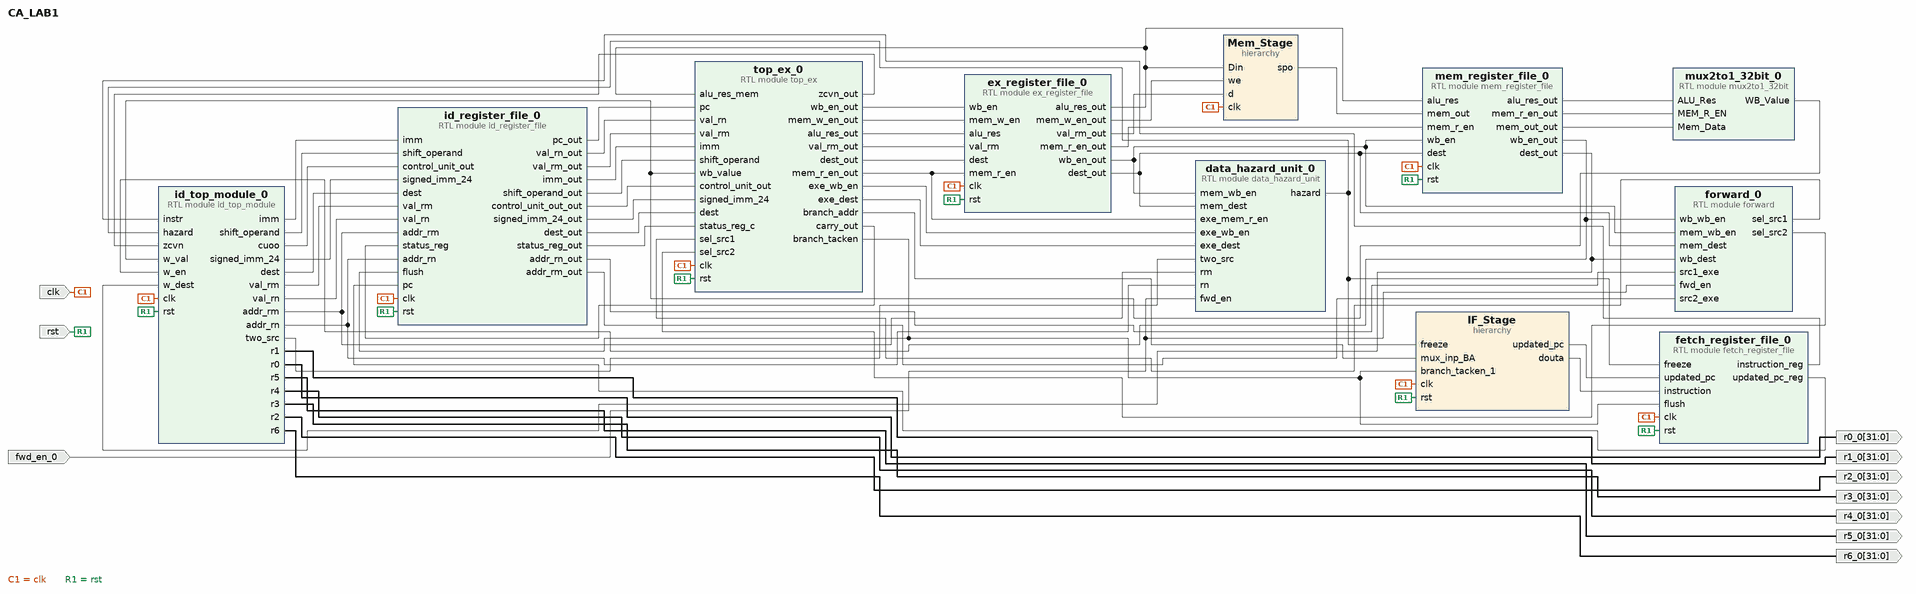
[diagram p0: block diagram of the top level]
# Vivado block design CA_LAB1, xc7z010clg400-1, Vivado 2018.3
create_bd_design CA_LAB1

create_bd_port -dir I -type clk clk
set_property -dict {CONFIG.ASSOCIATED_RESET rst} [get_bd_ports clk]
create_bd_port -dir I -type rst rst
create_bd_port -dir O -from 31 -to 0 r1_0
create_bd_port -dir O -from 31 -to 0 r0_0
create_bd_port -dir O -from 31 -to 0 r5_0
create_bd_port -dir O -from 31 -to 0 r4_0
create_bd_port -dir O -from 31 -to 0 r3_0
create_bd_port -dir O -from 31 -to 0 r2_0
create_bd_port -dir O -from 31 -to 0 r6_0
create_bd_port -dir I fwd_en_0

create_bd_cell -type module -reference fetch_register_file fetch_register_file_0
create_bd_cell -type hier IF_Stage
create_bd_cell -type module -reference mem_register_file mem_register_file_0
create_bd_cell -type module -reference mux2to1_32bit mux2to1_32bit_0
create_bd_cell -type hier Mem_Stage
create_bd_cell -type module -reference id_top_module id_top_module_0
create_bd_cell -type module -reference data_hazard_unit data_hazard_unit_0
create_bd_cell -type module -reference forward forward_0
create_bd_cell -type module -reference id_register_file id_register_file_0
create_bd_cell -type module -reference ex_register_file ex_register_file_0
create_bd_cell -type module -reference top_ex top_ex_0

# ---- hierarchy /IF_Stage ----
current_bd_instance /IF_Stage
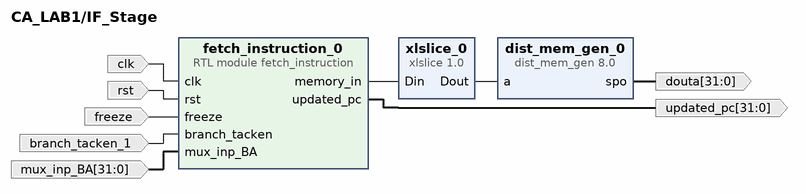
[diagram p1: block diagram inside /IF_Stage]
create_bd_pin -dir I -type clk clk
create_bd_pin -dir I -type rst rst
create_bd_pin -dir O -from 31 -to 0 updated_pc
create_bd_pin -dir O -from 31 -to 0 douta
create_bd_pin -dir I freeze
create_bd_pin -dir I branch_tacken_1
create_bd_pin -dir I -from 31 -to 0 mux_inp_BA

create_bd_cell -type ip -vlnv xilinx.com:ip:xlslice:1.0 xlslice_0
set_property -dict {CONFIG.DIN_FROM 12 CONFIG.DIN_TO 0 CONFIG.DOUT_WIDTH 13} [get_bd_cells xlslice_0]
create_bd_cell -type ip -vlnv xilinx.com:ip:dist_mem_gen:8.0 dist_mem_gen_0
set_property -dict [list \
  CONFIG.coefficient_file ../../../../../../../../Files/output_ultimate.coe \
  CONFIG.data_width 32 \
  CONFIG.depth 8192 \
  CONFIG.memory_type rom \
] [get_bd_cells dist_mem_gen_0]
create_bd_cell -type module -reference fetch_instruction fetch_instruction_0

# ---- hierarchy /Mem_Stage ----
current_bd_instance /Mem_Stage
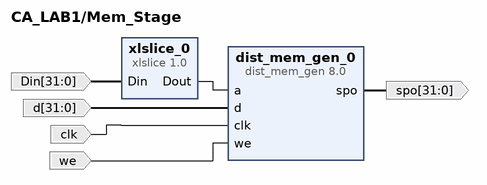
[diagram p2: block diagram inside /Mem_Stage]
create_bd_pin -dir I -from 31 -to 0 Din
create_bd_pin -dir I -from 31 -to 0 d
create_bd_pin -dir I clk
create_bd_pin -dir I we
create_bd_pin -dir O -from 31 -to 0 spo

create_bd_cell -type ip -vlnv xilinx.com:ip:xlslice:1.0 xlslice_0
set_property -dict {CONFIG.DIN_FROM 10 CONFIG.DOUT_WIDTH 11} [get_bd_cells xlslice_0]
create_bd_cell -type ip -vlnv xilinx.com:ip:dist_mem_gen:8.0 dist_mem_gen_0
set_property -dict {CONFIG.data_width 32 CONFIG.depth 2048} [get_bd_cells dist_mem_gen_0]

# ---- connections ----

current_bd_instance /IF_Stage
connect_bd_net [get_bd_pins fetch_instruction_0/memory_in] [get_bd_pins xlslice_0/Din]
connect_bd_net -net clk_0_1 [get_bd_pins clk] [get_bd_pins fetch_instruction_0/clk]
connect_bd_net -net debouncer_0_SIGNAL_O [get_bd_pins rst] [get_bd_pins fetch_instruction_0/rst]
connect_bd_net [get_bd_pins fetch_instruction_0/updated_pc] [get_bd_pins updated_pc]
connect_bd_net [get_bd_pins xlslice_0/Dout] [get_bd_pins dist_mem_gen_0/a]
connect_bd_net [get_bd_pins dist_mem_gen_0/spo] [get_bd_pins douta]
connect_bd_net [get_bd_pins freeze] [get_bd_pins fetch_instruction_0/freeze]
connect_bd_net -net branch_tacken1_1 [get_bd_pins branch_tacken_1] [get_bd_pins fetch_instruction_0/branch_tacken]
connect_bd_net [get_bd_pins mux_inp_BA] [get_bd_pins fetch_instruction_0/mux_inp_BA]

current_bd_instance /Mem_Stage
connect_bd_net [get_bd_pins xlslice_0/Dout] [get_bd_pins dist_mem_gen_0/a]
connect_bd_net -net ex_register_file_0_alu_res_out [get_bd_pins Din] [get_bd_pins xlslice_0/Din]
connect_bd_net -net ex_register_file_0_val_rm_out [get_bd_pins d] [get_bd_pins dist_mem_gen_0/d]
connect_bd_net -net clk_0_1 [get_bd_pins clk] [get_bd_pins dist_mem_gen_0/clk]
connect_bd_net -net ex_register_file_0_mem_w_en_out [get_bd_pins we] [get_bd_pins dist_mem_gen_0/we]
connect_bd_net [get_bd_pins dist_mem_gen_0/spo] [get_bd_pins spo]

current_bd_instance /
connect_bd_net -net clk_0_1 [get_bd_ports clk] \
  [get_bd_pins fetch_register_file_0/clk] [get_bd_pins IF_Stage/clk] [get_bd_pins mem_register_file_0/clk] \
  [get_bd_pins Mem_Stage/clk] [get_bd_pins id_top_module_0/clk] [get_bd_pins id_register_file_0/clk] \
  [get_bd_pins ex_register_file_0/clk] [get_bd_pins top_ex_0/clk]
connect_bd_net -net fetch_instruction_0_updated_pc [get_bd_pins IF_Stage/updated_pc] [get_bd_pins fetch_register_file_0/updated_pc]
connect_bd_net -net blk_mem_gen_0_douta [get_bd_pins IF_Stage/douta] [get_bd_pins fetch_register_file_0/instruction]
connect_bd_net -net debouncer_0_SIGNAL_O [get_bd_ports rst] \
  [get_bd_pins fetch_register_file_0/rst] [get_bd_pins IF_Stage/rst] [get_bd_pins mem_register_file_0/rst] \
  [get_bd_pins id_top_module_0/rst] [get_bd_pins id_register_file_0/rst] [get_bd_pins ex_register_file_0/rst] \
  [get_bd_pins top_ex_0/rst]
connect_bd_net [get_bd_pins fetch_register_file_0/instruction_reg] [get_bd_pins id_top_module_0/instr]
connect_bd_net [get_bd_pins id_top_module_0/imm] [get_bd_pins id_register_file_0/imm]
connect_bd_net [get_bd_pins id_top_module_0/shift_operand] [get_bd_pins id_register_file_0/shift_operand]
connect_bd_net [get_bd_pins id_top_module_0/cuoo] [get_bd_pins id_register_file_0/control_unit_out]
connect_bd_net [get_bd_pins id_top_module_0/signed_imm_24] [get_bd_pins id_register_file_0/signed_imm_24]
connect_bd_net [get_bd_pins id_top_module_0/dest] [get_bd_pins id_register_file_0/dest]
connect_bd_net [get_bd_pins id_top_module_0/val_rm] [get_bd_pins id_register_file_0/val_rm]
connect_bd_net [get_bd_pins id_top_module_0/val_rn] [get_bd_pins id_register_file_0/val_rn]
connect_bd_net [get_bd_pins fetch_register_file_0/updated_pc_reg] [get_bd_pins id_register_file_0/pc]
connect_bd_net [get_bd_pins id_register_file_0/pc_out] [get_bd_pins top_ex_0/pc]
connect_bd_net [get_bd_pins id_register_file_0/val_rn_out] [get_bd_pins top_ex_0/val_rn]
connect_bd_net [get_bd_pins id_register_file_0/val_rm_out] [get_bd_pins top_ex_0/val_rm]
connect_bd_net [get_bd_pins id_register_file_0/imm_out] [get_bd_pins top_ex_0/imm]
connect_bd_net [get_bd_pins id_register_file_0/shift_operand_out] [get_bd_pins top_ex_0/shift_operand]
connect_bd_net [get_bd_pins id_register_file_0/control_unit_out_out] [get_bd_pins top_ex_0/control_unit_out]
connect_bd_net [get_bd_pins id_register_file_0/signed_imm_24_out] [get_bd_pins top_ex_0/signed_imm_24]
connect_bd_net [get_bd_pins id_register_file_0/dest_out] [get_bd_pins top_ex_0/dest]
connect_bd_net [get_bd_pins id_register_file_0/status_reg_out] [get_bd_pins top_ex_0/status_reg_c]
connect_bd_net [get_bd_pins top_ex_0/wb_en_out] [get_bd_pins ex_register_file_0/wb_en]
connect_bd_net [get_bd_pins top_ex_0/mem_r_en_out] [get_bd_pins ex_register_file_0/mem_r_en] [get_bd_pins data_hazard_unit_0/exe_mem_r_en]
connect_bd_net [get_bd_pins top_ex_0/mem_w_en_out] [get_bd_pins ex_register_file_0/mem_w_en]
connect_bd_net [get_bd_pins top_ex_0/alu_res_out] [get_bd_pins ex_register_file_0/alu_res]
connect_bd_net [get_bd_pins top_ex_0/val_rm_out] [get_bd_pins ex_register_file_0/val_rm]
connect_bd_net [get_bd_pins top_ex_0/dest_out] [get_bd_pins ex_register_file_0/dest]
connect_bd_net [get_bd_pins top_ex_0/exe_wb_en] [get_bd_pins data_hazard_unit_0/exe_wb_en]
connect_bd_net [get_bd_pins top_ex_0/exe_dest] [get_bd_pins data_hazard_unit_0/exe_dest]
connect_bd_net [get_bd_pins top_ex_0/branch_tacken] \
  [get_bd_pins fetch_register_file_0/flush] [get_bd_pins IF_Stage/branch_tacken_1] [get_bd_pins id_register_file_0/flush]
connect_bd_net [get_bd_pins data_hazard_unit_0/hazard] \
  [get_bd_pins fetch_register_file_0/freeze] [get_bd_pins IF_Stage/freeze] [get_bd_pins id_top_module_0/hazard]
connect_bd_net [get_bd_pins top_ex_0/branch_addr] [get_bd_pins IF_Stage/mux_inp_BA]
connect_bd_net [get_bd_pins top_ex_0/carry_out] [get_bd_pins id_register_file_0/status_reg]
connect_bd_net [get_bd_pins top_ex_0/zcvn_out] [get_bd_pins id_top_module_0/zcvn]
connect_bd_net [get_bd_pins id_top_module_0/two_src] [get_bd_pins data_hazard_unit_0/two_src]
connect_bd_net [get_bd_pins ex_register_file_0/wb_en_out] \
  [get_bd_pins mem_register_file_0/wb_en] [get_bd_pins data_hazard_unit_0/mem_wb_en] [get_bd_pins forward_0/mem_wb_en]
connect_bd_net [get_bd_pins ex_register_file_0/dest_out] \
  [get_bd_pins mem_register_file_0/dest] [get_bd_pins data_hazard_unit_0/mem_dest] [get_bd_pins forward_0/mem_dest]
connect_bd_net [get_bd_pins mem_register_file_0/wb_en_out] [get_bd_pins id_top_module_0/w_en] [get_bd_pins forward_0/wb_wb_en]
connect_bd_net [get_bd_pins mem_register_file_0/dest_out] [get_bd_pins id_top_module_0/w_dest] [get_bd_pins forward_0/wb_dest]
connect_bd_net [get_bd_pins ex_register_file_0/alu_res_out] \
  [get_bd_pins mem_register_file_0/alu_res] [get_bd_pins Mem_Stage/Din] [get_bd_pins top_ex_0/alu_res_mem]
connect_bd_net [get_bd_pins ex_register_file_0/mem_r_en_out] [get_bd_pins mem_register_file_0/mem_r_en]
connect_bd_net [get_bd_pins mem_register_file_0/alu_res_out] [get_bd_pins mux2to1_32bit_0/ALU_Res]
connect_bd_net [get_bd_pins mem_register_file_0/mem_r_en_out] [get_bd_pins mux2to1_32bit_0/MEM_R_EN]
connect_bd_net [get_bd_pins mem_register_file_0/mem_out_out] [get_bd_pins mux2to1_32bit_0/Mem_Data]
connect_bd_net [get_bd_pins mux2to1_32bit_0/WB_Value] [get_bd_pins id_top_module_0/w_val] [get_bd_pins top_ex_0/wb_value]
connect_bd_net [get_bd_pins id_top_module_0/addr_rm] [get_bd_pins data_hazard_unit_0/rm] [get_bd_pins id_register_file_0/addr_rm]
connect_bd_net [get_bd_pins id_top_module_0/addr_rn] [get_bd_pins data_hazard_unit_0/rn] [get_bd_pins id_register_file_0/addr_rn]
connect_bd_net -net dist_mem_gen_0_spo [get_bd_pins Mem_Stage/spo] [get_bd_pins mem_register_file_0/mem_out]
connect_bd_net [get_bd_pins ex_register_file_0/mem_w_en_out] [get_bd_pins Mem_Stage/we]
connect_bd_net [get_bd_pins ex_register_file_0/val_rm_out] [get_bd_pins Mem_Stage/d]
connect_bd_net [get_bd_pins forward_0/sel_src1] [get_bd_pins top_ex_0/sel_src1]
connect_bd_net [get_bd_pins forward_0/sel_src2] [get_bd_pins top_ex_0/sel_src2]
connect_bd_net [get_bd_pins id_register_file_0/addr_rn_out] [get_bd_pins forward_0/src1_exe]
connect_bd_net [get_bd_pins id_register_file_0/addr_rm_out] [get_bd_pins forward_0/src2_exe]
connect_bd_net [get_bd_pins id_top_module_0/r1] [get_bd_ports r1_0]
connect_bd_net [get_bd_pins id_top_module_0/r0] [get_bd_ports r0_0]
connect_bd_net [get_bd_pins id_top_module_0/r5] [get_bd_ports r5_0]
connect_bd_net [get_bd_pins id_top_module_0/r4] [get_bd_ports r4_0]
connect_bd_net [get_bd_pins id_top_module_0/r3] [get_bd_ports r3_0]
connect_bd_net [get_bd_pins id_top_module_0/r2] [get_bd_ports r2_0]
connect_bd_net [get_bd_pins id_top_module_0/r6] [get_bd_ports r6_0]
connect_bd_net -net fwd_en_0_1 [get_bd_ports fwd_en_0] [get_bd_pins data_hazard_unit_0/fwd_en] [get_bd_pins forward_0/fwd_en]

validate_bd_design
save_bd_design
